# EAGLE design uszko (EAGLE 6.3)
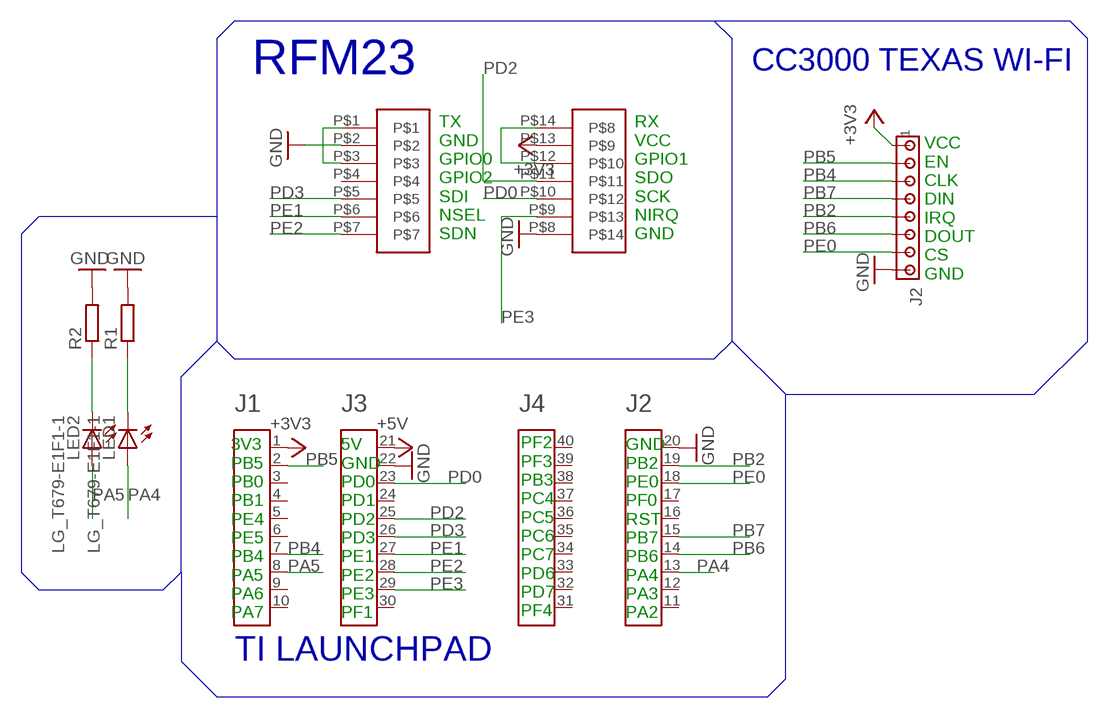
[diagram p0: schematic, sheet 1]

## Parts
A1  HEADER4X10-BOOSTERPACK  [4X10-BOOSTERPACK]
J2  MTA08-100  [10X08MTA]
LED1  LG_T679-E1F1-1  [PLCC2]
LED2  LG_T679-E1F1-1  [PLCC2]
R1  R-EU_R0805  [R0805]
R2  R-EU_R0805  [R0805]
U$1  2X7PIN  [2X7PINCON]

## Nets
+3V3: A1.1 J2.1 U$1.P$13
+5V: A1.21
GND: A1.20 A1.22 J2.8 R1.2 R2.2 U$1.P$2 U$1.P$8
N$1: U$1.P$12 U$1.P$14
N$2: U$1.P$1 U$1.P$3
N$3: LED1.C R1.1
N$4: LED2.C R2.1
PA4: A1.13 LED1.A
PA5: A1.8 LED2.A
PB2: A1.19 J2.5
PB4: A1.7 J2.3
PB5: A1.2 J2.2
PB6: A1.14 J2.6
PB7: A1.15 J2.4
PD0: A1.23 U$1.P$10
PD2: A1.25 U$1.P$11
PD3: A1.26 U$1.P$5
PE0: A1.18 J2.7
PE1: A1.27 U$1.P$6
PE2: A1.28 U$1.P$7
PE3: A1.29 U$1.P$9
Unconnected: A1.3 A1.4 A1.5 A1.6 A1.9 A1.10 A1.11 A1.12 A1.16 A1.17 A1.24 A1.30 A1.31 A1.32 A1.33 A1.34 A1.35 A1.36 A1.37 A1.38 A1.39 A1.40 U$1.P$4

## Buses
B$1

## Notes on the sheet
- RFM23 | CC3000 TEXAS WI-FI
- TX 
  GND
  GPIO0
  GPIO2
  SDI
  NSEL
  SDN
- RX 
  VCC
  GPIO1
  SDO
  SCK
  NIRQ
  GND
- VCC
  EN
  CLK
  DIN
  IRQ
  DOUT
  CS
  GND
- PF2
  PF3
  PB3
  PC4
  PC5
  PC6
  PC7
  PD6
  PD7
  PF4
- 3V3
  PB5
  PB0
  PB1
  PE4
  PE5
  PB4
  PA5
  PA6
  PA7
- 5V
  GND
  PD0
  PD1
  PD2
  PD3
  PE1
  PE2
  PE3
  PF1
- GND
  PB2
  PE0
  PF0
  RST
  PB7
  PB6
  PA4
  PA3
  PA2
- TI LAUNCHPAD

## Library data of the parts
A1 = EAGLE_BoosterPack_Library:HEADER4X10-BOOSTERPACK
J2 = con-amp:MTA08-100: AMP connector
LED1 LED2 = led:*_T679-?-1: LC TOPLED® Low Current LED Source: http://catalog.osram-os.com .. LG_LS_LY_T679_OBS.pdf; COLOR: green
R1 R2 = resistor:R-EU_: RESISTOR, European symbol
U$1 = ref-packages:2X7PIN

## Net classes
0 default: width 0.6 mm, drill 0.5 mm, clearance 0.4 mm

## Board
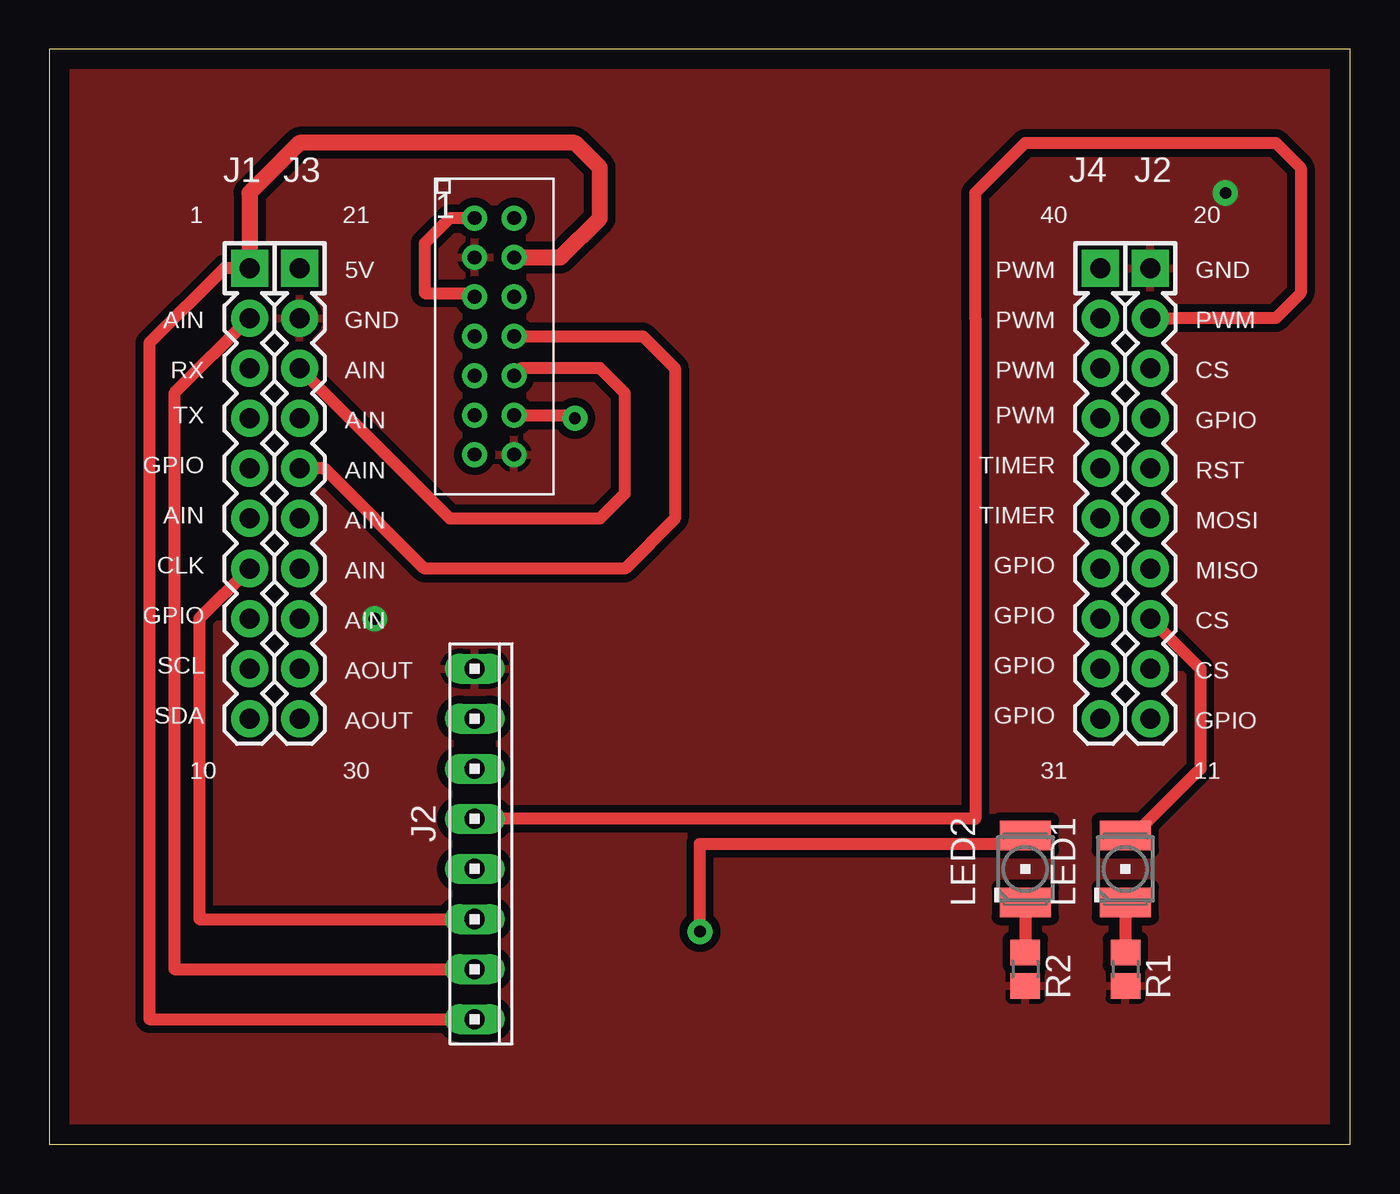
[diagram p1: board, top side]
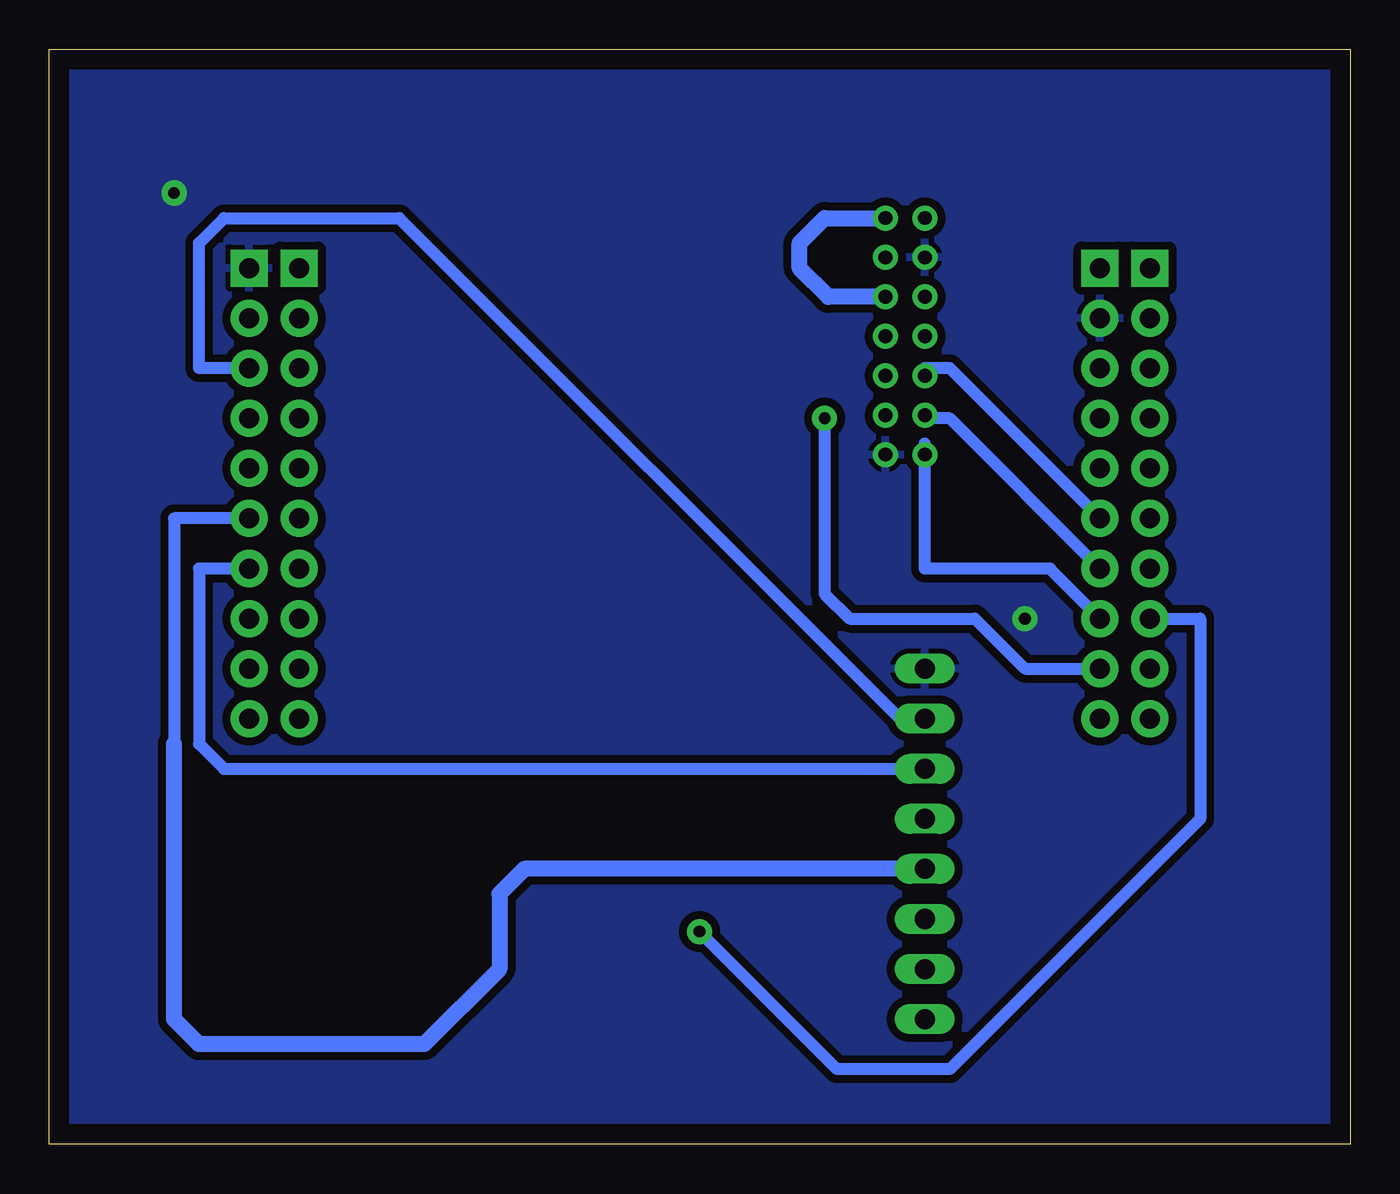
[diagram p2: board, bottom side, seen from below]

Size 66.02 x 55.55 mm. Coordinates in mm from the lower left corner, seen from the top.
Outline: 0,0 66.02,0 66.02,55.55 0,55.55 0,0
Copper layers (1*16): Top 0.035mm / dielectric 1.5mm / Bottom 0.035mm
Design rules "default": minimum track width 10mil, minimum drill 24mil, track to track 8mil, track to pad 8mil, pad to pad 8mil, via to via 8mil, smd to smd 8mil, copper to edge 40mil, drill to drill 8mil, minimum pad ring 10mil, minimum via ring 8mil, stop-mask expansion 4mil, vias tented up to drill 0mil, thermal gap 10mil

### Footprints (pad centres in the part's own frame; a part is rotated, then mirrored left to right if it is on the bottom)
4X10-BOOSTERPACK = drill 1.016 pad 1.88 square: 1 0,10.16; 20 45.72,10.16; 21 2.54,10.16; 40 43.18,10.16 | drill 1.016 pad 1.88: 2 0,7.62; 3 0,5.08; 4 0,2.54; 5 0,0; 6 0,-2.54; 7 0,-5.08; 8 0,-7.62; 9 0,-10.16; 10 0,-12.7; 11 45.72,-12.7; 12 45.72,-10.16; 13 45.72,-7.62; 14 45.72,-5.08; 15 45.72,-2.54; 16 45.72,0; 17 45.72,2.54; 18 45.72,5.08; 19 45.72,7.62; 22 2.54,7.62; 23 2.54,5.08; 24 2.54,2.54; 25 2.54,0; 26 2.54,-2.54; 27 2.54,-5.08; 28 2.54,-7.62; 29 2.54,-10.16; 30 2.54,-12.7; 31 43.18,-12.7; 32 43.18,-10.16; 33 43.18,-7.62; 34 43.18,-5.08; 35 43.18,-2.54; 36 43.18,0; 37 43.18,2.54; 38 43.18,5.08; 39 43.18,7.62
10X08MTA = drill 1.016 long: 1 8.89,0; 2 6.35,0; 3 3.81,0; 4 1.27,0; 5 -1.27,0; 6 -3.81,0; 7 -6.35,0; 8 -8.89,0
PLCC2 = smd 2.6 x 1.5: A 0,1.7; C 0,-1.7
R0805 = smd 1.3 x 1.5: 1 -0.85,0; 2 0.85,0
2X7PINCON = drill 0.7 pad 1.27: P$1 0,0; P$2 0,-2; P$3 0,-4; P$4 0,-6; P$5 0,-8; P$6 0,-10; P$7 0,-12; P$8 2,-12; P$9 2,-10; P$10 2,-8; P$11 2,-6; P$12 2,-4; P$13 2,-2; P$14 2,0

### Placement (x,y rotation side)
A1  10.16,34.29 0 top
J2  21.59,15.24 270 top
LED1  54.61,13.97 0 top
LED2  49.53,13.97 0 top
R1  54.61,8.89 270 top
R2  49.53,8.89 270 top
U$1  21.59,46.99 0 top

### Tracks (layer width: path | path; a pad name or v marks a point on that pad's centre or on a via)
+3V3
  Top 0.6: J2.1 5.08,6.35 5.08,40.64 8.89,44.45 A1.1
  Top 0.813: U$1.P$13 25.94,44.99 27.94,46.99 27.94,49.53 26.67,50.8 12.7,50.8 10.16,48.26 A1.1
GND  (via drill 0.6 pad 1.27)
  other vias: 16.51,26.67 59.69,48.26
  pour Bottom: -2.54,0 64.77,0 66.04,55.88 -1.27,55.88
  pour Top: -2.54,0 66.04,0 66.04,55.88 -2.54,55.88
N$1
  Bottom 0.813: U$1.P$12 26.48,42.99 27.94,44.45 27.94,45.72 26.67,46.99 U$1.P$14
N$2
  Top 0.6: U$1.P$1 20.32,46.99 19.05,45.72 19.05,43.18 21.59,43.18 U$1.P$3
N$3
  Top 0.6: R1.1 LED1.C 54.61,12.7
N$4
  Top 0.6: R2.1 LED2.C 49.53,12.7
PA4
  Top 0.6: A1.13 58.42,24.13 58.42,19.05 54.61,15.24 LED1.A
PA5  (via drill 0.6 pad 1.27)
  Top 0.6: v33.02,10.79 33.02,15.24 49.53,15.24 LED2.A
  Bottom 0.6: v33.02,10.79 26.03,3.81 20.32,3.81 7.62,16.51 7.62,26.67 A1.8
PB2
  Top 0.6: J2.5 46.99,16.51 46.99,41.91 | A1.19 57.15,41.91
  Top 0.61: 46.99,41.91 46.99,48.26 49.53,50.8 62.23,50.8 63.5,49.53 63.5,43.18 62.23,41.91 57.15,41.91
PB4
  Top 0.6: J2.3 7.62,11.43 7.62,26.67 A1.7
PB5
  Top 0.6: J2.2 6.35,8.89 6.35,38.1 A1.2
PB6
  Bottom 0.6: J2.6 57.15,19.05 58.42,20.32 58.42,29.21 A1.14
PB7
  Bottom 0.6: 59.69,19.05 59.69,20.32 59.69,31.75 A1.15
  Bottom 0.813: J2.4 41.91,13.97 43.18,12.7 43.18,8.89 46.99,5.08 58.42,5.08 59.69,6.35 59.69,20.32
PD0
  Top 0.61: A1.23 20.32,31.75 27.94,31.75 29.21,33.02 29.21,38.1 27.94,39.37 23.97,39.37 U$1.P$10
PD2
  Top 0.61: U$1.P$11 30.13,40.99 31.75,39.37 31.75,31.75 29.21,29.21 19.05,29.21 13.97,34.29 A1.25
PD3
  Bottom 0.6: A1.26 20.32,39.37 21.59,39.37 U$1.P$5
PE0
  Bottom 0.6: J2.7 22.86,21.59 48.26,46.99 57.15,46.99 58.42,45.72 58.42,39.37 A1.18
PE1
  Bottom 0.6: A1.27 20.32,36.83 21.59,36.83 U$1.P$6
PE2
  Bottom 0.6: A1.28 15.24,29.21 21.59,29.21 U$1.P$7 21.59,35.56
PE3  (via drill 0.6 pad 1.27)
  Top 0.61: U$1.P$9 26.51,36.99 v26.67,36.83
  Bottom 0.61: v26.67,36.83 26.67,27.94 25.4,26.67 19.05,26.67 16.51,24.13 A1.29